# Altium project AMC_FMC_Carrier v3.PrjPcb (part 3 of 4)

## Sheet SUP_1.2_1.8.SchDoc
size A4; DocumentNumber: 6; SheetNumber: 6; SheetTotal: 30
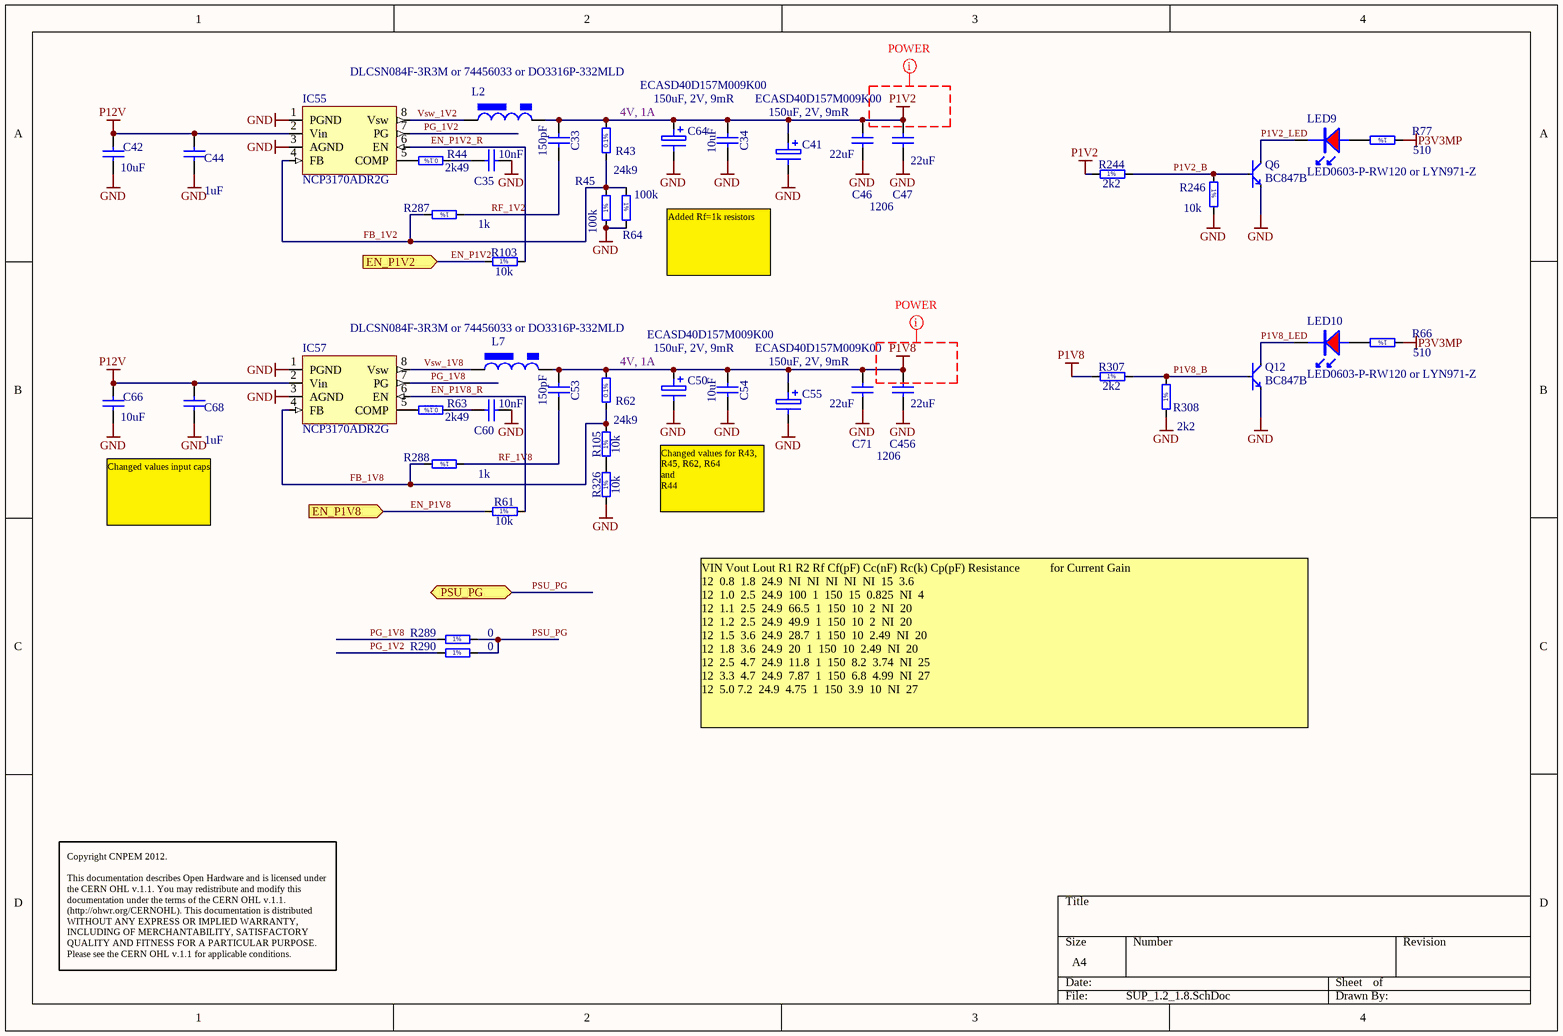
[diagram p6: SUP_1.2_1.8.SchDoc]

### Parts
C33  150pF  [CAPC1608X87N]
C34  10uF  [CAPC2012X135N]
C35  10nF  [CAPC1005X55N]
C41  ECASD40D157M009K00  value 150uF, 2V, 9mR  [2917_POLY]
C42  10uF  [CAPC2012X135N]
C44  1uF  [CAPC1608X87N]
C46  22uF  [CAPC3216X180N]
C47  22uF  Case: 1206  [CAPC3216X180N]
C50  ECASD40D157M009K00  value 150uF, 2V, 9mR  [2917_POLY]
C53  150pF  [CAPC1608X87N]
C54  10uF  [CAPC2012X135N]
C55  ECASD40D157M009K00  value 150uF, 2V, 9mR  [2917_POLY]
C60  10nF  [CAPC1005X55N]
C64  ECASD40D157M009K00  value 150uF, 2V, 9mR  [2917_POLY]
C66  10uF  [CAPC2012X135N]
C68  1uF  [CAPC1608X87N]
C71  22uF  [CAPC3216X180N]
C456  22uF  Case: 1206  [CAPC3216X180N]
IC55  NCP3170ADR2G  [so-8]
IC57  NCP3170ADR2G  [so-8]
L2  DLCSN084F-3R3M or 74456033 or DO3316P-332MLD  [IND_CSN084F]
L7  DLCSN084F-3R3M or 74456033 or DO3316P-332MLD  [IND_CSN084F]
LED9  LED0603-P-RW120 or LYN971-Z  [led_0603R]
LED10  LED0603-P-RW120 or LYN971-Z  [led_0603R]
Q6  BC847B  [SOT-23]
Q12  BC847B  [SOT-23]
R43  24k9  [RESC1608X55N]
R44  2k49  [RESC1608X55N]
R45  100k  [RESC1005X40N]
R61  10k  [RESC1005X40N]
R62  24k9  [RESC1608X55N]
R63  2k49  [RESC1608X55N]
R64  100k  [RESC1005X40N]
R66  510  [RESC1005X40N]
R77  510  [RESC1005X40N]
R103  10k  [RESC1005X40N]
R105  10k  [RESC1005X40N]
R244  2k2  [RESC1005X40N]
R246  10k  [RESC1005X40N]
R287  1k  [RESC1005X40N]
R288  1k  [RESC1005X40N]
R289  0  [RESC1005X40N]
R290  0  [RESC1005X40N]
R307  2k2  [RESC1005X40N]
R308  2k2  [RESC1005X40N]
R326  10k  [RESC1005X40N]

### Ports
EN_P1V2 (in), EN_P1V8 (in), PSU_PG

### Nets
GND: C34.2 C35.2 C41.2 C42.1 C44.1 C46.2 C47.2 C50.2 C54.2 C55.2 C60.2 C64.2 C66.1 C68.1 C71.2 C456.2 IC55.1(PGND) IC55.3(AGND) IC57.1(PGND) IC57.3(AGND) Q6.2(E) Q12.2(E) R45.1 R64.2 R246.2 R308.1 R326.1
P1V2: C33.1 C34.1 C41.1 C46.1 C47.1 C64.1 L2.2 R43.2 R244.1
P1V8: C50.1 C53.1 C54.1 C55.1 C71.1 C456.1 L7.2 R62.2 R307.1
P3V3MP: R66.1 R77.1
P12V: C42.2 C44.2 C66.2 C68.2 IC55.2(Vin) IC57.2(Vin)
EN_P1V2: R103.1 ; port EN_P1V2
EN_P1V2_R: IC55.6(EN) R103.2
EN_P1V8: R61.1 ; port EN_P1V8
EN_P1V8_R: IC57.6(EN) R61.2
FB_1V2: IC55.4(FB) R43.1 R45.2 R64.1 R287.2
FB_1V8: IC57.4(FB) R62.1 R105.2 R288.2
P1V2_B: Q6.1(B) R244.2 R246.1
P1V2_LED: LED9.K Q6.3(C)
P1V8_B: Q12.1(B) R307.2 R308.2
P1V8_LED: LED10.K Q12.3(C)
PG_1V2: IC55.7(PG) R290.2
PG_1V8: IC57.7(PG) R289.2
PSU_PG: R289.1 R290.1 ; port PSU_PG  [project net PGOOD_P1V0]
RF_1V2: C33.2 R287.1
RF_1V8: C53.2 R288.1
Vsw_1V2: IC55.8(Vsw) L2.1
Vsw_1V8: IC57.8(Vsw) L7.1
NetC35_1: C35.1 R44.1
NetC60_1: C60.1 R63.1
NetIC55_5: IC55.5(COMP) R44.2
NetIC57_5: IC57.5(COMP) R63.2
NetLED9_A: LED9.A R77.2
NetLED10_A: LED10.A R66.2
NetR105_1: R105.1 R326.2

### Layout directives
net class POWER: P1V2, P1V8

### Notes on the sheet
- 4V, 1A
- Added Rf=1k resistors
- Changed values input caps
- Changed values for R43, R45, R62, R64
  and
  R44
- VIN	Vout	Lout	R1	R2	Rf	Cf(pF)	Cc(nF)	Rc(k)	Cp(pF) Resistance 									for Current Gain
  12 	0.8 	1.8 	24.9 	NI 	NI 	NI 	NI 	NI 	15 	3.6
  12 	1.0 	2.5 	24.9 	100 	1 	150 	15 	0.825 	NI 	4
  12 	1.1 	2.5 	24.9 	66.5 	1 	150 	10 	2 	NI 	20
  12 	1.2 	2.5 	24.9 	49.9 	1 	150 	10 	2 	NI 	20
  12 	1.5 	3.6 	24.9 	28.7 	1 	150 	10 	2.49 	NI 	20
  12 	1.8 	3.6 	24.9 	20 	1 	150 	10 	2.49 	NI 	20
  12 	2.5 	4.7 	24.9 	11.8 	1 	150 	8.2 	3.74 	NI 	25
  12 	3.3 	4.7 	24.9 	7.87 	1 	150 	6.8 	4.99 	NI 	27
  12 	5.0	7.2 	24.9 	4.75 	1 	150 	3.9 	10 	NI 	27
- Copyright CNPEM 2012.
  This documentation describes Open Hardware and is licensed under the CERN OHL v.1.1. You may redistribute and modify this documentation under the terms of the CERN OHL v.1.1. (http://ohwr.org/CERNOHL). This documentation is distributed WITHOUT ANY EXPRESS OR IMPLIED WARRANTY, INCLUDING OF MERCHANTABILITY, SATISFACTORY QUALITY AND FITNESS FOR A PARTICULAR PURPOSE. Please see the CERN OHL v.1.1 for applicable conditions.
- (in symbol R0402_0R_JUMPER) 1%
- (in symbol R0402_1K_1%_0.0625W_100PPM) 1%
- (in symbol R0402_2K2_1%_0.0625W_100PPM) 1%
- (in symbol R0402_10K_1%_0.0625W_100PPM) 1%
- (in symbol R0402_100K_1%_0.0625W_100PPM) 1%
- (in symbol R0402_510R_1%_0.0625W_100PPM) 1%
- (in symbol R0603_2K49_0.1%_0.063W_10PPM) 0.1%
- (in symbol R0603_24K9_0.1%_0.063W_10PPM) 0.1%

### Library data of the parts
C33 C53 = CC0603_150PF_50V_5%_NP0: Non-polarised capacitor; Part Description: SMD Multilayer Chip Ceramic Capacitor; Manufacturer: GENERIC; Manufacturer1 Part Number: 223886715151; Voltage: 50V; TC: NP0; Tolerance: ±5%; Table: Capacitors SMD; Part Number: CC0603_150PF_50V_5%_NP0; Component Kind: Standard; Component Type: Standard; Pin Count: 2; Value: 150pF; Status: Preferred; Manufacturer Part Number: CC0603_150PF_50V_5%_NP0; Case: 0603; Mounted: Yes; Socket: No; SMD: Yes; Manufacturer1 Example: PHYCOMP; Manufacturer1 ComponentHeight: 0.87mm; HelpURL: \\cern.ch\dfs\Applications\Altium\Datasheets\CC0603_NP0_PHYCOMP.pdf; Author: CERN DEM JLC; CreateDate: 2007-12-03; LatestRevisionDate: 2007-12-03
C34 C42 C54 C66 = CC0805_10UF_16V_10%_X5R: Non-polarised capacitor; Part Description: SMD Multilayer Chip Ceramic Capacitor; Manufacturer: GENERIC; Manufacturer1 Part Number: C0805C106K4PAC; Voltage: 16V; TC: X5R; Tolerance: ±10%; Table: Capacitors SMD; Part Number: CC0805_10UF_16V_10%_X5R; Component Kind: Standard; Component Type: Standard; Pin Count: 2; Value: 10uF; Status: Preferred; Manufacturer Part Number: CC0805_10UF_16V_10%_X5R; Case: 0805; Mounted: Yes; Socket: No; SMD: Yes; Manufacturer1 Example: KEMET; Manufacturer1 ComponentHeight: 1.4mm; HelpURL: \\cern.ch\dfs\Applications\Altium\Datasheets\CC1206_X5R_KEMET.pdf; Author: CERN DEM JLC; CreateDate: 2007-12-03; LatestRevisionDate: 2007-12-03
C35 C60 = CC0402_10NF_16V_10%_X7R: Non-polarised capacitor; Part Description: SMD Multilayer Chip Ceramic Capacitor; Manufacturer: GENERIC; Manufacturer1 Part Number: 223878715636; Voltage: 16V; TC: X7R; Tolerance: ±10%; Table: Capacitors SMD; Part Number: CC0402_10NF_16V_10%_X7R; Component Kind: Standard; Component Type: Standard; Pin Count: 2; Value: 10nF; Status: Not Recommended; Manufacturer Part Number: CC0402_10NF_16V_10%_X7R; Case: 0402; Mounted: Yes; Socket: No; SMD: Yes; Manufacturer1 Example: PHYCOMP; Manufacturer1 ComponentHeight: 0.55mm; HelpURL: \\cern.ch\dfs\Applications\Altium\Datasheets\CC0402_X7R_PHYCOMP.pdf; Author: CERN DEM JLC; CreateDate: 2007-12-03; LatestRevisionDate: 2007-12-03
C41 C50 C55 C64 = CAP_POLYMER: POLY, 150uF, 2V, ESR: 9mR
C44 C68 = CC0603_1UF_16V_10%_X7R: as C816 on sheet POWER_Management; Part Number: CC0603_1UF_16V_10%_X7R; Component Kind: Standard; Component Type: Standard; Pin Count: 2; Value: 1uF; Status: Preferred; Manufacturer Part Number: CC0603_1uF_16V_10%_X7R; Case: 0603; Mounted: Yes; Socket: No; SMD: Yes; Manufacturer1 Example: PHYCOMP; Manufacturer1 ComponentHeight: 0.87mm; HelpURL: \\cern.ch\dfs\Applications\Altium\Datasheets\CC0805_X5R_PHYCOMP_HC.pdf; Author: CERN DEM JLC; CreateDate: 2007-12-03; LatestRevisionDate: 2007-12-03
C46 C47 C71 C456 = CC1206_22UF_10V_10%_X7R: Non-polarised capacitor; Part Description: SMD Multilayer Chip Ceramic Capacitor; Manufacturer: GENERIC; Manufacturer1 Part Number: GRM31CR71A226KE15L; Voltage: 10V; TC: X7R; Tolerance: ±10%; Table: Capacitors SMD; Part Number: CC1206_22UF_10V_10%_X7R; Component Kind: Standard; Component Type: Standard; Pin Count: 2; Value: 22uF; Status: Preferred; Manufacturer Part Number: CC1206_22UF_10V_10%_X7R; Mounted: Yes; Socket: No; SMD: Yes; Manufacturer1 Example: MURATA; Manufacturer1 ComponentHeight: 1.8mm; HelpURL: \\cern.ch\dfs\Applications\Altium\Datasheets\CC1206_X7R_MURATA_GRM-HI-CAP.pdf; Author: CERN DEM JLC; CreateDate: 08/06/2010; LatestRevisionDate: 08/06/2010
IC55 IC57 = PWM_NCP3170: 4.5V to 18V, 3A synch buck
L2 L7 = L_POWER_CSN084F_3R3: 3.3uH, 20%, 5.4A, 0.015R
LED9 LED10 = LED_0603R: LED 0603 red; Supplier 1: Newark; Supplier Part Number 1: 22M3004; Supplier 2: Newark; Supplier Part Number 2: 20M0618
Q6 Q12 = Q_BC847B: Transistor
R43 R62 = R0603_24K9_0.1%_0.063W_10PPM: Resistor - 0.1%; Part Description: Thin Film Chip Resistor; Manufacturer: GENERIC; Manufacturer1 Part Number: RN73C1J24K9BTDF; Power: 0.063W; TC: ±10ppm; Table: Resistors SMD; Part Number: R0603_24K9_0.1%_0.063W_10PPM; Component Kind: Standard; Component Type: Standard; Pin Count: 2; Value: 24k9; Status: Not recommended; Tolerance: ±0.1%; Manufacturer Part Number: R0603_24K9_0.1%_0.063W_10PPM; Case: 0603; Mounted: Yes; Socket: No; SMD: Yes; Manufacturer1 Example: TYCO HOLSWORTHY; Manufacturer1 ComponentHeight: 0.5mm; HelpURL: \\cern.ch\dfs\Applications\Altium\Datasheets\R0603_Tyco_RN73.pdf; Author: CERN DEM JLC; CreateDate: 2007-12-03; LatestRevisionDate: 2008-03-13
R44 R63 = R0603_2K49_0.1%_0.063W_10PPM: Resistor - 0.1%; Part Description: Thin Film Chip Resistor; Manufacturer: GENERIC; Manufacturer1 Part Number: RN73C1J2K49BTDF; Power: 0.063W; TC: ±10ppm; Table: Resistors SMD; Part Number: R0603_2K49_0.1%_0.063W_10PPM; Component Kind: Standard; Component Type: Standard; Pin Count: 2; Value: 2k49; Status: Not recommended; Tolerance: ±0.1%; Manufacturer Part Number: R0603_2K49_0.1%_0.063W_10PPM; Case: 0603; Mounted: Yes; Socket: No; SMD: Yes; Manufacturer1 Example: TYCO HOLSWORTHY; Manufacturer1 ComponentHeight: 0.5mm; HelpURL: \\cern.ch\dfs\Applications\Altium\Datasheets\R0603_Tyco_RN73.pdf; Author: CERN DEM JLC; CreateDate: 2007-12-03; LatestRevisionDate: 2008-03-13
R45 R64 = R0402_100K_1%_0.0625W_100PPM: as R269 on sheet POWER_Management; Part Number: R0402_100K_1%_0.0625W_100PPM; Component Kind: Standard; Component Type: Standard; Pin Count: 2; Value: 100k; Status: Not recommended; Power: 0.0625W; Tolerance: ±1%; Manufacturer Part Number: R0402_100K_1%_0.0625W_100PPM; Case: 0402; Mounted: Yes; Socket: No; SMD: Yes; Manufacturer1 Example: YAGEO PHYCOMP; Manufacturer1 ComponentHeight: 0.4mm; HelpURL: \\cern.ch\dfs\Applications\Altium\Datasheets\R0402_Phycomp_RC0402.pdf; Author: CERN DEM JLC; CreateDate: 2007-12-03; LatestRevisionDate: 2012-10-17
R61 R103 R105 R246 R326 = R0402_10K_1%_0.0625W_100PPM: as R37-R40 on sheet POWER_Management; Part Number: R0402_10K_1%_0.0625W_100PPM; Component Kind: Standard; Component Type: Standard; Pin Count: 2; Value: 10k; Status: Not recommended; Power: 0.0625W; Tolerance: ±1%; Manufacturer Part Number: R0402_10K_1%_0.0625W_100PPM; Case: 0402; Mounted: Yes; Socket: No; SMD: Yes; Manufacturer1 Example: YAGEO PHYCOMP; Manufacturer1 ComponentHeight: 0.4mm; HelpURL: \\cern.ch\dfs\Applications\Altium\Datasheets\R0402_Phycomp_RC0402.pdf; Author: CERN DEM JLC; CreateDate: 2007-12-03; LatestRevisionDate: 2012-10-17
R66 R77 = R0402_510R_1%_0.0625W_100PPM: Resistor - 1%; Part Description: General Purpose Thick Film Chip Resistor; Manufacturer: GENERIC; Manufacturer1 Part Number: 232270675101L; TC: ±100ppm/°C; Table: Resistors SMD; Part Number: R0402_510R_1%_0.0625W_100PPM; Component Kind: Standard; Component Type: Standard; Pin Count: 2; Value: 510; Status: Not recommended; Power: 0.0625W; Tolerance: ±1%; Manufacturer Part Number: R0402_510R_1%_0.0625W_100PPM; Case: 0402; Mounted: Yes; Socket: No; SMD: Yes; Manufacturer1 Example: YAGEO PHYCOMP; Manufacturer1 ComponentHeight: 0.4mm; HelpURL: \\cern.ch\dfs\Applications\Altium\Datasheets\R0402_Phycomp_RC0402.pdf; Author: CERN DEM JLC; CreateDate: 2007-12-03; LatestRevisionDate: 2012-10-17
R244 R307 R308 = R0402_2K2_1%_0.0625W_100PPM: Resistor - 1%; Part Description: General Purpose Thick Film Chip Resistor; Manufacturer: GENERIC; Manufacturer1 Part Number: 232270672202L; TC: ±100ppm/°C; Table: Resistors SMD; Part Number: R0402_2K2_1%_0.0625W_100PPM; Component Kind: Standard; Component Type: Standard; Pin Count: 2; Value: 2k2; Status: Not recommended; Power: 0.0625W; Tolerance: ±1%; Manufacturer Part Number: R0402_2K2_1%_0.0625W_100PPM; Case: 0402; Mounted: Yes; Socket: No; SMD: Yes; Manufacturer1 Example: YAGEO PHYCOMP; Manufacturer1 ComponentHeight: 0.4mm; HelpURL: \\cern.ch\dfs\Applications\Altium\Datasheets\R0402_Phycomp_RC0402.pdf; Author: CERN DEM JLC; CreateDate: 2007-12-03; LatestRevisionDate: 2012-10-17
R287 R288 = R0402_1K_1%_0.0625W_100PPM: Resistor - 1%; Part Description: General Purpose Thick Film Chip Resistor; Manufacturer: GENERIC; Manufacturer1 Part Number: 232270671002L; TC: ±100ppm/°C; Table: Resistors SMD; Part Number: R0402_1K_1%_0.0625W_100PPM; Component Kind: Standard; Component Type: Standard; Pin Count: 2; Value: 1k; Status: Not recommended; Power: 0.0625W; Tolerance: ±1%; Manufacturer Part Number: R0402_1K_1%_0.0625W_100PPM; Case: 0402; Mounted: Yes; Socket: No; SMD: Yes; Manufacturer1 Example: YAGEO PHYCOMP; Manufacturer1 ComponentHeight: 0.4mm; HelpURL: \\cern.ch\dfs\Applications\Altium\Datasheets\R0402_Phycomp_RC0402.pdf; Author: CERN DEM JLC; CreateDate: 2007-12-03; LatestRevisionDate: 2012-10-17
R289 R290 = R0402_0R_JUMPER: Resistor - 1%; Part Description: 1A (0.05R Max DC Resistance) Zero Ohm Jumper; Manufacturer: GENERIC; Manufacturer1 Part Number: 232270591001L; Table: Resistors SMD; Part Number: R0402_0R_JUMPER; Component Kind: Standard; Component Type: Standard; Pin Count: 2; Value: 0; Status: Not recommended; Manufacturer Part Number: R0402_0R_JUMPER; Case: 0402; Mounted: Yes; Socket: No; SMD: Yes; Manufacturer1 Example: YAGEO PHYCOMP; Manufacturer1 ComponentHeight: 0.4mm; HelpURL: \\cern.ch\dfs\Applications\Altium\Datasheets\R0402_Phycomp_RC0402.pdf; Author: CERN DEM JLC; CreateDate: 2007-12-03; LatestRevisionDate: 2012-10-17

## Sheet UI_mon.SchDoc
size A4; DocumentNumber: 28; SheetNumber: 28; SheetTotal: 30
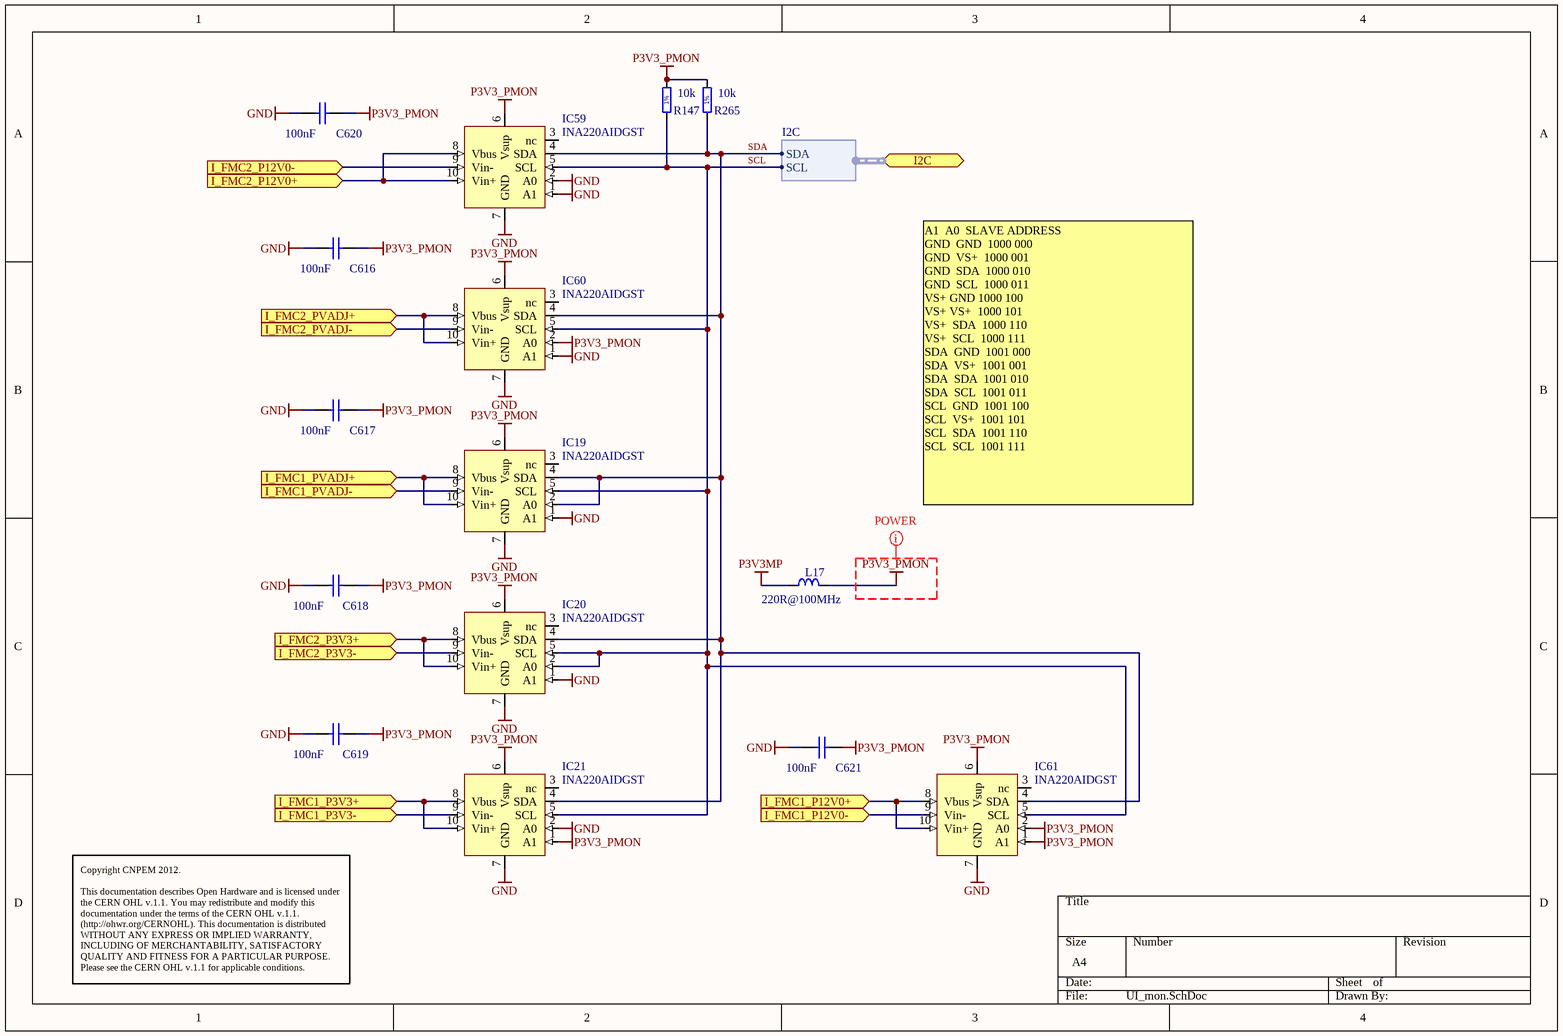
[diagram p7: UI_mon.SchDoc]

### Parts
C616  100nF  [CAPC0603X33N]
C617  100nF  [CAPC0603X33N]
C618  100nF  [CAPC0603X33N]
C619  100nF  [CAPC0603X33N]
C620  100nF  [CAPC0603X33N]
C621  100nF  [CAPC0603X33N]
IC19  INA220AIDGST  [msop10]
IC20  INA220AIDGST  [msop10]
IC21  INA220AIDGST  [msop10]
IC59  INA220AIDGST  [msop10]
IC60  INA220AIDGST  [msop10]
IC61  INA220AIDGST  [msop10]
L17  220R@100MHz  [INDC2012X105N]
R147  10k  [RESC1005X40N]
R265  10k  [RESC1005X40N]

### Ports
I2C (harness I2C), I_FMC1_P3V3+ (in), I_FMC1_P3V3- (in), I_FMC1_P12V0+ (in), I_FMC1_P12V0- (in), I_FMC1_PVADJ+ (in), I_FMC1_PVADJ- (in), I_FMC2_P3V3+ (in), I_FMC2_P3V3- (in), I_FMC2_P12V0+ (in), I_FMC2_P12V0- (in), I_FMC2_PVADJ+ (in), I_FMC2_PVADJ- (in)

### Harnesses
I2C: SCL, SDA

### Nets
GND: C616.2 C617.2 C618.2 C619.2 C620.2 C621.2 IC19.1(A1) IC19.7(GND) IC20.1(A1) IC20.7(GND) IC21.2(A0) IC21.7(GND) IC59.1(A1) IC59.2(A0) IC59.7(GND) IC60.1(A1) IC60.7(GND) IC61.7(GND)
P3V3_PMON: C616.1 C617.1 C618.1 C619.1 C620.1 C621.1 IC19.6(Vsup) IC20.6(Vsup) IC21.1(A1) IC21.6(Vsup) IC59.6(Vsup) IC60.2(A0) IC60.6(Vsup) IC61.1(A1) IC61.2(A0) IC61.6(Vsup) L17.2 R147.2 R265.2
P3V3MP: L17.1
I_FMC1_P3V3n: IC21.9(Vin-) ; port I_FMC1_P3V3-
I_FMC1_P3V3p: IC21.8(Vbus) IC21.10(Vin+) ; port I_FMC1_P3V3+
I_FMC1_P12V0+: IC61.8(Vbus) IC61.10(Vin+) ; port I_FMC1_P12V0+
I_FMC1_P12V0-: IC61.9(Vin-) ; port I_FMC1_P12V0-
I_FMC1_PADJn: IC19.9(Vin-) ; port I_FMC1_PVADJ-
I_FMC1_PADJp: IC19.8(Vbus) IC19.10(Vin+) ; port I_FMC1_PVADJ+
I_FMC2_P3V3n: IC20.9(Vin-) ; port I_FMC2_P3V3-
I_FMC2_P3V3p: IC20.8(Vbus) IC20.10(Vin+) ; port I_FMC2_P3V3+
I_FMC2_P12V0+: IC59.8(Vbus) IC59.10(Vin+) ; port I_FMC2_P12V0+
I_FMC2_P12V0-: IC59.9(Vin-) ; port I_FMC2_P12V0-
I_FMC2_PADJn: IC60.9(Vin-) ; port I_FMC2_PVADJ-
I_FMC2_PADJp: IC60.8(Vbus) IC60.10(Vin+) ; port I_FMC2_PVADJ+
SCL: IC19.5(SCL) IC20.2(A0) IC20.5(SCL) IC21.5(SCL) IC59.5(SCL) IC60.5(SCL) IC61.5(SCL) R147.1 ; port I2C.SCL
SDA: IC19.2(A0) IC19.4(SDA) IC20.4(SDA) IC21.4(SDA) IC59.4(SDA) IC60.4(SDA) IC61.4(SDA) R265.1 ; port I2C.SDA

Not connected (* = marked no-connect by the designer): IC19 3(nc); IC20 3(nc); IC21 3(nc); IC59 3(nc); IC60 3(nc); IC61 3(nc)

### Layout directives
net class POWER: P3V3_PMON

### Notes on the sheet
- A1 	A0 	SLAVE ADDRESS
  GND 	GND 	1000 000
  GND 	VS+ 	1000 001
  GND 	SDA 	1000 010
  GND 	SCL 	1000 011
  VS+	GND	1000 100
  VS+	VS+ 	1000 101
  VS+ 	SDA 	1000 110
  VS+ 	SCL 	1000 111
  SDA 	GND 	1001 000
  SDA 	VS+ 	1001 001
  SDA 	SDA 	1001 010
  SDA 	SCL 	1001 011
  SCL 	GND 	1001 100
  SCL 	VS+ 	1001 101
  SCL 	SDA 	1001 110
  SCL 	SCL 	1001 111
- Copyright CNPEM 2012.
  This documentation describes Open Hardware and is licensed under the CERN OHL v.1.1. You may redistribute and modify this documentation under the terms of the CERN OHL v.1.1. (http://ohwr.org/CERNOHL). This documentation is distributed WITHOUT ANY EXPRESS OR IMPLIED WARRANTY, INCLUDING OF MERCHANTABILITY, SATISFACTORY QUALITY AND FITNESS FOR A PARTICULAR PURPOSE. Please see the CERN OHL v.1.1 for applicable conditions.
- (in symbol R0402_10K_1%_0.0625W_100PPM) 1%

### Library data of the parts
C616-C621 = CC0201_100NF_6.3V_10%_X5R: as C219-C225 on sheet FPGA_MGT; Part Number: CC0201_100NF_6.3V_10%_X5R; Component Kind: Standard; Component Type: Standard; Pin Count: 2; Value: 100nF; Status: Not Recommended; Manufacturer Part Number: CC0201_100NF_6.3V_10%_X5R; Case: 0201; Mounted: Yes; Socket: No; SMD: Yes; Manufacturer1 Example: AVX; Manufacturer1 ComponentHeight: 0.33mm; HelpURL: \\cern.ch\dfs\Applications\Altium\Datasheets\CC0201_X5R_AVX.pdf; Author: CERN DEM JLC; CreateDate: 2007-12-03; LatestRevisionDate: 2007-12-03
IC19-IC21 IC59-IC61 = ADC_INA220: CURRENT/POWER MONITOR with Two-Wire Interface
L17 = IND0805_MURATA_BLM21PG221SN1D: Inductor; Part Description: SMD EMIFIL Suppression Chip Bead Ferrite; Manufacturer: MURATA; Power: 2A; Resistance: 0.05R; Tolerance: ±25%; Table: Inductors SMD; Part Number: IND0805_MURATA_BLM21PG221SN1D; Component Kind: Standard; Component Type: Standard; Pin Count: 2; Value: 220R@100MHz; Status: None; Manufacturer Part Number: BLM21PG221SN1D; Case: 0805; Mounted: Yes; Socket: No; SMD: Yes; ComponentHeight: 1.05mm; HelpURL: \\cern.ch\dfs\Applications\Altium\Datasheets\IND0402_MURATA_BLM21P.pdf; Author: CERN DEM JLC; CreateDate: 25/01/2010; LatestRevisionDate: 25/01/2010
R147 R265 = R0402_10K_1%_0.0625W_100PPM: as R37-R40 on sheet POWER_Management; Part Number: R0402_10K_1%_0.0625W_100PPM; Component Kind: Standard; Component Type: Standard; Pin Count: 2; Value: 10k; Status: Not recommended; Power: 0.0625W; Tolerance: ±1%; Manufacturer Part Number: R0402_10K_1%_0.0625W_100PPM; Case: 0402; Mounted: Yes; Socket: No; SMD: Yes; Manufacturer1 Example: YAGEO PHYCOMP; Manufacturer1 ComponentHeight: 0.4mm; HelpURL: \\cern.ch\dfs\Applications\Altium\Datasheets\R0402_Phycomp_RC0402.pdf; Author: CERN DEM JLC; CreateDate: 2007-12-03; LatestRevisionDate: 2012-10-17